# Altium schematic sheet TGA3042.SchDoc: FMC SDR Frontend
size 420 x 297 mm; CheckedBy: -; CompanyName: CERN; DrawnBy: DrawnBy; Organization: CERN; Address1: European Organization for Nuclear Research; Address2: CH-1211 Genčve 23 - Switzerland; Revision: -; SheetNumber: -; SheetTotal: -; EDA_Number: EDA-XXXXX-VX-X; Projet: -; ModifiedBy: -; CreateDate: XX/XX/XXXX; CheckedDate: -; Title2: Power Amplifier; DivGrp: TE/MPE; Designer: Designer; ModifiedDate: -
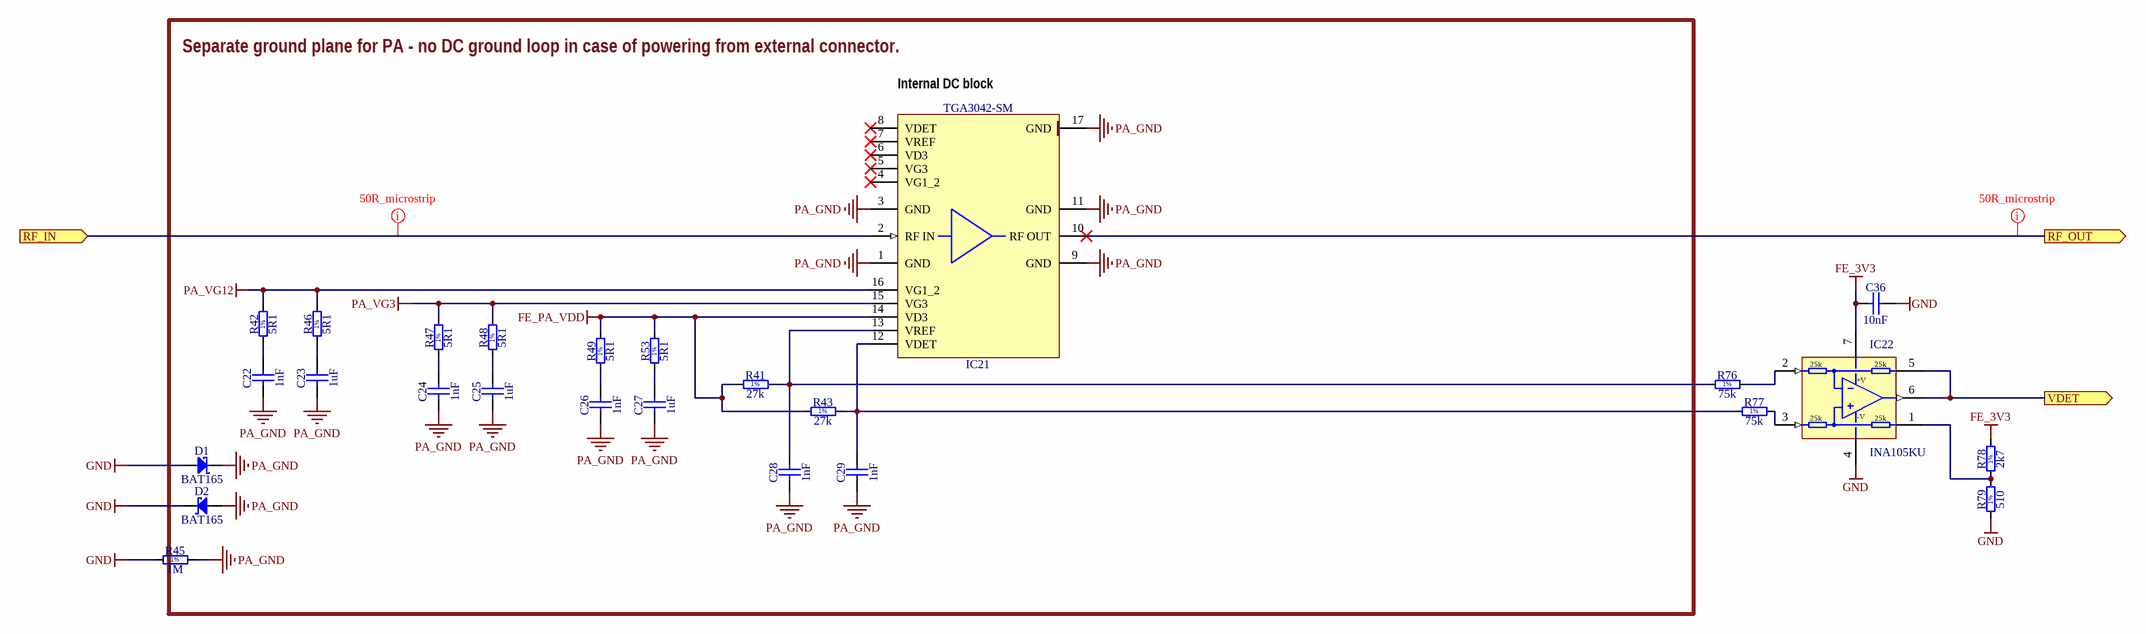
[diagram p0: TGA3042.SchDoc]

## Parts
C22  1nF  [CAPC1005X55N]
C23  1uF  [CAPC3216X140N]
C24  1nF  [CAPC1005X55N]
C25  1uF  [CAPC3216X140N]
C26  1nF  [CAPC1005X55N]
C27  1uF  [CAPC3216X140N]
C28  1nF  [CAPC1005X55N]
C29  1nF  [CAPC1005X55N]
C36  10nF  [CAPC1005X55N]
D1  BAT165  [SOD2512X110N]
D2  BAT165  [SOD2512X110N]
IC21  TGA3042-SM  [QORVO_TGA3042-SM]
IC22  INA105KU  [SOIC127P600X175-8N]
R41  27k  [RESC1005X40N]
R42  5R1  [RESC1005X40N]
R43  27k  [RESC1005X40N]
R45  1M  [RESC1005X40N]
R46  5R1  [RESC1005X40N]
R47  5R1  [RESC1005X40N]
R48  5R1  [RESC1005X40N]
R49  5R1  [RESC1005X40N]
R53  5R1  [RESC1005X40N]
R76  75k  [RESC1608X55N]
R77  75k  [RESC1608X55N]
R78  2k7  [RESC1608X55N]
R79  510  [RESC1608X55N]

## Ports
RF_IN (in), RF_OUT (out), VDET (out)

## Nets
FE_3V3: C36.1 IC22.7(+VCC) R78.2
FE_PA_VDD: IC21.14(VD3) R41.1 R43.1 R49.2 R53.2
GND: C36.2 D1.2(A) D2.1(C) IC22.4(-VEE) R45.1 R79.1
PA_GND: C22.1 C23.1 C24.1 C25.1 C26.1 C27.1 C28.1 C29.1 D1.1(C) D2.2(A) IC21.1(GND) IC21.3(GND) IC21.9(GND) IC21.11(GND) IC21.17(GND) R45.2
PA_VG3: IC21.15(VG3) R47.2 R48.2
PA_VG12: IC21.16(VG1_2) R42.2 R46.2
RF_IN: IC21.2(RF_IN) ; port RF_IN
RF_OUT: IC21.10(RF_OUT) ; port RF_OUT
VDET: IC22.5(SENS) IC22.6(OUT) ; port VDET
NetC22_2: C22.2 R42.1
NetC23_2: C23.2 R46.1
NetC24_2: C24.2 R47.1
NetC25_2: C25.2 R48.1
NetC26_2: C26.2 R49.1
NetC27_2: C27.2 R53.1
NetC28_2: C28.2 IC21.13(VREF) R41.2 R76.1
NetC29_2: C29.2 IC21.12(VDET) R43.2 R77.1
NetIC22_1: IC22.1(REF) R78.1 R79.2
NetIC22_2: IC22.2(IN-) R76.2
NetIC22_3: IC22.3(IN+) R77.2

Not connected (* = marked no-connect by the designer): IC21 4(VG1_2)* 5(VG3)* 6(VD3)* 7(VREF)* 8(VDET)*

## Layout directives
net class 50R_class: RF_IN, RF_OUT

## Notes on the sheet
- Separate ground plane for PA - no DC ground loop in case of powering from external connector.
- (near IC21) Internal DC block
- Project/Equipment
- Document
- Designer
- Drawn by
- Check.by
- File
- Last Mod.
- Print Date
- Sheet
- Size
- A3
- of
- Rev
- (in symbol INA105KU) 25k; +V; -V
- (in symbol R0402_1M_1%_0.0625W_100PPM) 1%
- (in symbol R0402_5R1_1%_0.0625W_100PPM) 1%
- (in symbol R0402_27K_1%_0.0625W_100PPM) 1%
- (in symbol R0603_2K7_1%_0.1W_100PPM) 1%
- (in symbol R0603_75K_1%_0.1W_100PPM) 1%
- (in symbol R0603_510R_1%_0.1W_100PPM) 1%

## Library data of the parts
C22 C24 C26 C28 C29 = CC0402_1NF_50V_10%_X7R: Non-polarised capacitor; Part Description: SMD Multilayer Chip Ceramic Capacitor; Manufacturer: GENERIC; Manufacturer1 Part Number: 223858715623; Voltage: 50V; TC: X7R; Tolerance: ±10%; Part Number: CC0402_1NF_50V_10%_X7R; Component Kind: Standard; Component Type: Standard; Pin Count: 2; Value: 1nF; Status: Not Recommended; Manufacturer Part Number: CC0402_1NF_50V_10%_X7R; Case: 0402; Mounted: Yes; Socket: No; SMD: Yes; Sense: No; Manufacturer1 Example: PHYCOMP; Manufacturer1 ComponentHeight: 0.55mm; HelpURL: \\cern.ch\dfs\Applications\Altium\Datasheets\CC0402_X7R_PHYCOMP.pdf; Author: CERN DEM JLC; CreateDate: 03.12.2007; LatestRevisionDate: 03.12.2007
C23 C25 C27 = CC1206_1UF_50V_10%_X7R: Non-polarised capacitor; Part Description: SMD Multilayer Chip Ceramic Capacitor; Manufacturer: GENERIC; Manufacturer1 Part Number: C1206F105K5RACTU; Voltage: 50V; TC: X7R; Tolerance: ±10%; Part Number: CC1206_1UF_50V_10%_X7R; Component Kind: Standard; Component Type: Standard; Pin Count: 2; Value: 1uF; Status: Preferred; Manufacturer Part Number: CC1206_1UF_50V_10%_X7R; Case: 1206; Mounted: Yes; Socket: No; SMD: Yes; Sense: No; Manufacturer1 Example: KEMET; Manufacturer1 ComponentHeight: 1.8mm; HelpURL: \\cern.ch\dfs\Applications\Altium\Datasheets\CC1206_X7R_KEMET_OPENMODE.pdf; Author: CERN DEM JLC; CreateDate: 07.11.2012; LatestRevisionDate: 07.11.2012
C36 = CC0402_10NF_50V_10%_X7R: Non-polarised capacitor; Part Description: SMD Multilayer Chip Ceramic Capacitor; Manufacturer: GENERIC; Manufacturer1 Part Number: GRM155R71H103KA88D; Voltage: 50V; TC: X7R; Tolerance: ±10%; Part Number: CC0402_10NF_50V_10%_X7R; Component Kind: Standard; Component Type: Standard; Pin Count: 2; Value: 10nF; Status: None; Manufacturer Part Number: CC0402_10NF_50V_10%_X7R; Case: 0402; Mounted: Yes; Socket: No; SMD: Yes; Sense: No; Manufacturer1 Example: MURATA; Manufacturer1 ComponentHeight: 0.55mm; HelpURL: \\cern.ch\dfs\Applications\Altium\Datasheets\CC0402_X7R_MURATA_GRM.pdf; Author: CERN DEM MR; CreateDate: 08.01.2016; LatestRevisionDate: 08.01.2016
D1 D2 = BAT165: Schottky Diode; Part Description: Medium Power AF Schottky Diode; Manufacturer: INFINEON; Voltage: 40V; Power: 750mA; PressFit: No; Bonding: No; Part Number: BAT165; Component Kind: Standard; Component Type: Standard; Device: BAT165; PackageDescription: Small Outline Diode (SOD-323), 1.70mm W X 1.25mm L X 1.10mm H body,  IPC Medium Density; Manufacturer Part Number: BAT165; Pin Count: 2; Case: SOD323; Mounted: Yes; Socket: No; SMD: Yes; Sense: No; ComponentHeight: 1.1mm; HelpURL: \\cern.ch\dfs\Applications\Altium\Datasheets\BAT165.pdf; Author: CERN DEM JLC; CreateDate: 12.11.2014; LatestRevisionDate: 12.11.2014
IC21 = TGA3042-SM: 7-10.5GHz 4.5W GaN Power Amplifier; Manufacturer: QORVO; PressFit: No; Bonding: No; Part Number: TGA3042-SM; Component Kind: Standard; Component Type: Standard; Device: TGA3042-SM; PackageDescription: QFN, 0.566mm Pitch X, 0.525 Pitch Y, Square; 16 Pin, 4.5mm L X 4.5mm W X 1.74mm H Body; Part Description: 7-10.5GHz 4.5W GaN Power Amplifier; Manufacturer Part Number: TGA3042-SM; Pin Count: 17; Case: QFN16; Mounted: Yes; Socket: No; SMD: Yes; Sense: No; ComponentHeight: 1.91mm; Author: CERN DEM JLC; HelpURL: \\cern.ch\dfs\Applications\Altium\Datasheets\TGA3042-SM.pdf; CreateDate: 26.03.2019; LatestRevisionDate: 26.03.2019
IC22 = INA105KU: Precision, Unity-Gain Differential Amplifier; Manufacturer: TEXAS INSTRUMENTS; PressFit: No; Bonding: No; Part Number: INA105KU; Component Kind: Standard; Component Type: Standard; Device: INA105KU; PackageDescription: SOIC 8, Pitch 1.27mm, Body 4x5mm, IPC Medium Density; Part Description: Precision, Unity-Gain Differential Amplifier; Manufacturer Part Number: INA105KU; Pin Count: 7; Case: SOIC8; Mounted: Yes; Socket: No; SMD: Yes; Sense: No; ComponentHeight: 1.75mm; Author: CERN DEM JLC; HelpURL: \\cern.ch\dfs\Applications\Altium\Datasheets\INA105KU.pdf; CreateDate: 07.01.2008; LatestRevisionDate: 07.01.2008
R41 R43 = R0402_27K_1%_0.0625W_100PPM: Resistor - 1%; Part Description: General Purpose Thick Film Chip Resistor; Manufacturer: GENERIC; Manufacturer1 Part Number: 232270672703L; TC: ±100ppm/°C; PressFit: No; Part Number: R0402_27K_1%_0.0625W_100PPM; Component Kind: Standard; Component Type: Standard; Pin Count: 2; Value: 27k; Status: Not Recommended; Power: 0.0625W; Tolerance: ±1%; Manufacturer Part Number: R0402_27K_1%_0.0625W_100PPM; Case: 0402; Mounted: Yes; Sense: No; Socket: No; SMD: Yes; Manufacturer1 Example: YAGEO PHYCOMP; Manufacturer1 ComponentHeight: 0.4mm; HelpURL: \\cern.ch\dfs\Applications\Altium\Datasheets\R0402_Phycomp_RC0402.pdf; Author: CERN DEM JLC; CreateDate: 03.12.2007; LatestRevisionDate: 17.10.2012
R42 R46-R49 R53 = R0402_5R1_1%_0.0625W_100PPM: Resistor - 1%; Part Description: General Purpose Thick Film Chip Resistor; Manufacturer: GENERIC; Manufacturer1 Part Number: CRCW04025R10FKED; TC: ±100ppm/°C; PressFit: No; Part Number: R0402_5R1_1%_0.0625W_100PPM; Component Kind: Standard; Component Type: Standard; Pin Count: 2; Value: 5R1; Status: Not Recommended; Power: 0.0625W; Tolerance: ±1%; Manufacturer Part Number: R0402_5R1_1%_0.0625W_100PPM; Case: 0402; Mounted: Yes; Sense: No; Socket: No; SMD: Yes; Manufacturer1 Example: VISHAY; Manufacturer1 ComponentHeight: 0.4mm; HelpURL: \\cern.ch\dfs\Applications\Altium\Datasheets\R0402_VISHAY_CRCW e3.pdf; Author: CERN DEM MR; CreateDate: 22.11.2016; LatestRevisionDate: 22.11.2016
R45 = R0402_1M_1%_0.0625W_100PPM: Resistor - 1%; Part Description: General Purpose Thick Film Chip Resistor; Manufacturer: GENERIC; Manufacturer1 Part Number: 232270671005L; TC: ±100ppm/°C; PressFit: No; Part Number: R0402_1M_1%_0.0625W_100PPM; Component Kind: Standard; Component Type: Standard; Pin Count: 2; Value: 1M; Status: Not Recommended; Power: 0.0625W; Tolerance: ±1%; Manufacturer Part Number: R0402_1M_1%_0.0625W_100PPM; Case: 0402; Mounted: Yes; Sense: No; Socket: No; SMD: Yes; Manufacturer1 Example: YAGEO PHYCOMP; Manufacturer1 ComponentHeight: 0.4mm; HelpURL: \\cern.ch\dfs\Applications\Altium\Datasheets\R0402_Phycomp_RC0402.pdf; Author: CERN DEM JLC; CreateDate: 03.12.2007; LatestRevisionDate: 17.10.2012
R76 R77 = R0603_75K_1%_0.1W_100PPM: Resistor - 1%; Part Description: General Purpose Thick Film Chip Resistor; Manufacturer: GENERIC; Manufacturer1 Part Number: NRC06F7502TRF; Power: 0.1W; TC: ±100ppm/°C; PressFit: No; Part Number: R0603_75K_1%_0.1W_100PPM; Component Kind: Standard; Component Type: Standard; Pin Count: 2; Value: 75k; Status: Preferred; Tolerance: ±1%; Manufacturer Part Number: R0603_75K_1%_0.1W_100PPM; Case: 0603; Mounted: Yes; Sense: No; Socket: No; SMD: Yes; Manufacturer1 Example: NIC COMPONENT; Manufacturer1 ComponentHeight: 0.55mm; HelpURL: \\cern.ch\dfs\Applications\Altium\Datasheets\R0603_NIC_NRC.pdf; Author: CERN DEM JLC; CreateDate: 03.12.2007; LatestRevisionDate: 13.03.2008
R78 = R0603_2K7_1%_0.1W_100PPM: Resistor - 1%; Part Description: General Purpose Thick Film Chip Resistor; Manufacturer: GENERIC; Manufacturer1 Part Number: RC0603FR-072K7L; Power: 0.1W; TC: ±100ppm/°C; PressFit: No; Part Number: R0603_2K7_1%_0.1W_100PPM; Component Kind: Standard; Component Type: Standard; Pin Count: 2; Value: 2k7; Status: Preferred; Tolerance: ±1%; Manufacturer Part Number: R0603_2K7_1%_0.1W_100PPM; Case: 0603; Mounted: Yes; Sense: No; Socket: No; SMD: Yes; Manufacturer1 Example: YAGEO PHYCOMP; Manufacturer1 ComponentHeight: 0.55mm; HelpURL: \\cern.ch\dfs\Applications\Altium\Datasheets\R0603_PHYCOMP_RC0603.pdf; Author: CERN DEM JLC; CreateDate: 02.05.2011; LatestRevisionDate: 02.05.2011
R79 = R0603_510R_1%_0.1W_100PPM: Resistor - 1%; Part Description: General Purpose Thick Film Chip Resistor; Manufacturer: GENERIC; Manufacturer1 Part Number: CRCW0603510RFKEA; Power: 0.1W; TC: ±100ppm/°C; PressFit: No; Part Number: R0603_510R_1%_0.1W_100PPM; Component Kind: Standard; Component Type: Standard; Pin Count: 2; Value: 510; Status: Preferred; Tolerance: ±1%; Manufacturer Part Number: R0603_510R_1%_0.1W_100PPM; Case: 0603; Mounted: Yes; Sense: No; Socket: No; SMD: Yes; Manufacturer1 Example: VISHAY; Manufacturer1 ComponentHeight: 0.5mm; HelpURL: \\cern.ch\dfs\Applications\Altium\Datasheets\R0603_VISHAY_CRCW e3.pdf; Author: CERN DEM JLC; CreateDate: 03.12.2007; LatestRevisionDate: 21.03.2018